# EAGLE design ws2812_Pentagon (EAGLE 8.7.1)
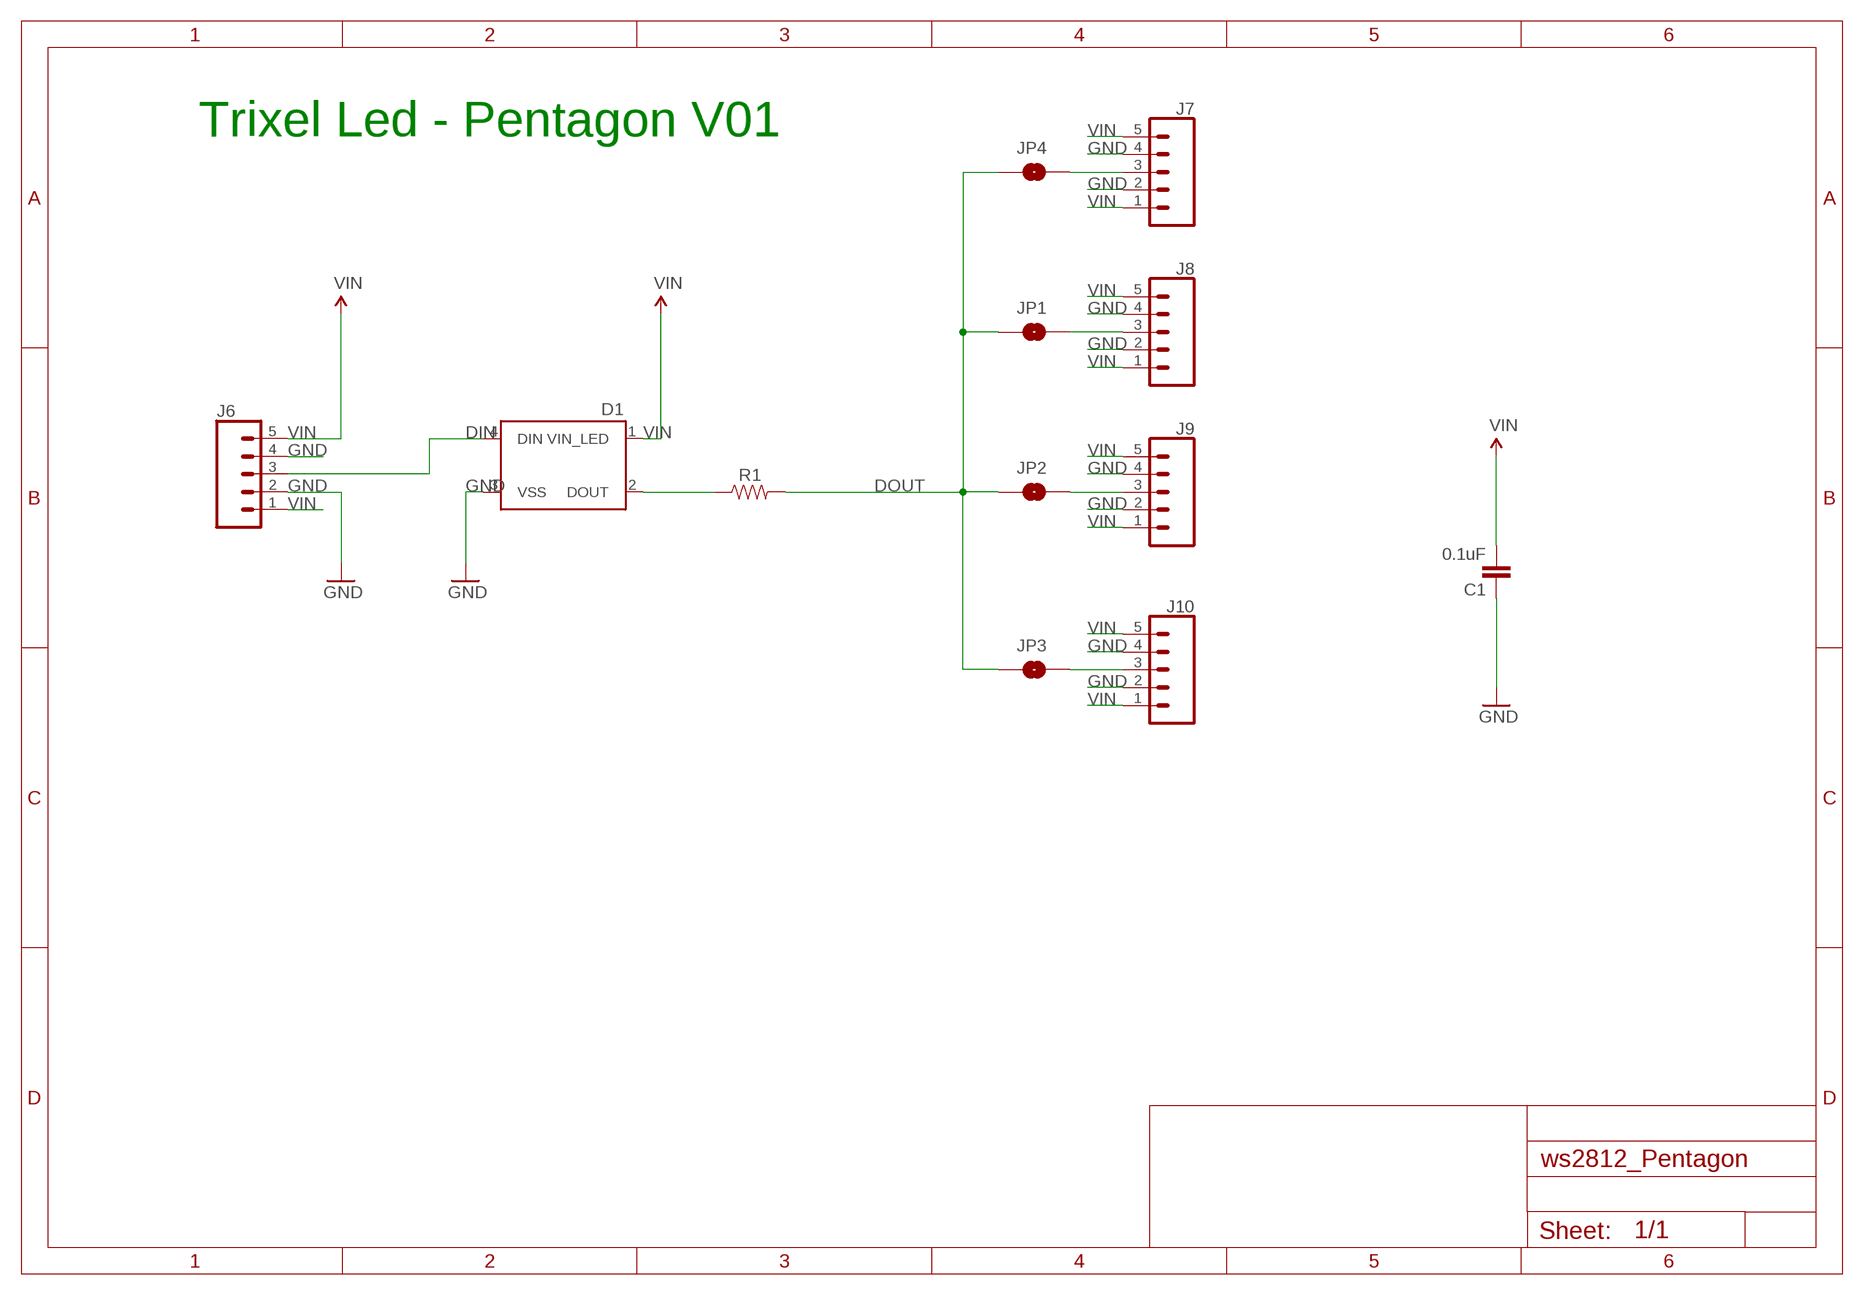
[diagram p0: schematic, sheet 1]

## Parts
C1  0.1uF  CAP0805  [0805]
D1  WS2812B  [WS2812B]
J6  CONN_05PTH_LONGPADS  [1X05_LONGPADS]
J7  CONN_05PTH_LONGPADS  [1X05_LONGPADS]
J8  CONN_05PTH_LONGPADS  [1X05_LONGPADS]
J9  CONN_05PTH_LONGPADS  [1X05_LONGPADS]
J10  CONN_05PTH_LONGPADS  [1X05_LONGPADS]
JP1  JUMPER-PAD-2-NOYES_SILK  [PAD-JUMPER-2-NO_YES_SILK]
JP2  JUMPER-PAD-2-NOYES_SILK  [PAD-JUMPER-2-NO_YES_SILK]
JP3  JUMPER-PAD-2-NOYES_SILK  [PAD-JUMPER-2-NO_YES_SILK]
JP4  JUMPER-PAD-2-NOYES_SILK  [PAD-JUMPER-2-NO_YES_SILK]
R1  RESISTOR0805  [0805]

## Nets
DIN: D1.4(DIN) J6.3
DOUT: JP1.1 JP2.1 JP3.1 JP4.1 R1.2
GND: C1.1 D1.3(VSS) J6.2 J6.4 J7.2 J7.4 J8.2 J8.4 J9.2 J9.4 J10.2 J10.4
N$1: J9.3 JP2.2
N$2: J8.3 JP1.2
N$3: D1.2(DOUT) R1.1
N$4: J7.3 JP4.2
N$5: J10.3 JP3.2
VIN: C1.2 D1.1(VIN_LED) J6.1 J6.5 J7.1 J7.5 J8.1 J8.5 J9.1 J9.5 J10.1 J10.5

## Notes on the sheet
- Trixel Led - Pentagon V01

## Library data of the parts
C1 = SparkFun-Capacitors:CAP: Capacitor Standard 0603 ceramic capacitor, and 0.1" leaded capacitor.
D1 = SparkFun-LED:WS2812B: WS2812B - Intelligent control LED integrated light source Technical Specifications: Power Supply Voltage (VDD): 3.5 to 5.3 V Input Voltage (VI): -0.5 to VDD+0.5 V Operating Junction Temperature (Topt): -25°C to +80°C Storage Temperature Range (Tstg): -55°C to +150°C; PROD_ID: DIO-12503
J6-J10 = SparkFun-Connectors:CONN_05: Multi connection point. Often used as Generic Header-pin footprint for 0.1 inch spaced/style header connections On any of the 0.1 inch spaced packages, you can populate with these: Break Away Headers - Straight <https://www.sparkfun.com/products/116> (PRT-00116) Break Away Male Headers - Right Angle <https://www.sparkfun.com/products/553> (PRT-00553) Female Headers <https://www.sparkfun.com/products/115> (PRT-00115) Break Away Headers - Machine Pin <https://www.sparkfun.com/products/117> (PRT-00117) Break Away Female Headers - Swiss Machine Pin <https://www.sparkfun.com/products/743> (PRT-00743) For SCREWTERMINALS and SPRING TERMINALS visit here: Screw Terimnals on SparkFun.com <https://www.sparkfun.com/search/results?term=Screw+Terminals> (5mm/3.5mm/2.54mm spacing) This device is also useful as a general connection point to wire up your design to another part of your project. Our various solder wires solder well into these plated through hole pads. Hook-Up Wire - Assortment (Stranded, 22 AWG) <https://www.sparkfun.com/products/11375> (PRT-11375) Hook-Up Wire - Assortment (Solid Core, 22 AWG) <https://www.sparkfun.com/products/11367> (PRT-11367) View the entire wire category on our website here <https://www.sparkfun.com/categories/141> Special notes: Molex polarized connector foot print use with SKU : PRT-08231 with associated crimp pins and housings. 1MM SMD Version SKU: PRT-10208
JP1-JP4 = SparkFun-Passives:JUMPER-PAD-2-NO
R1 = SparkFun-Resistors:RESISTOR: Generic Resistor Package

## Board
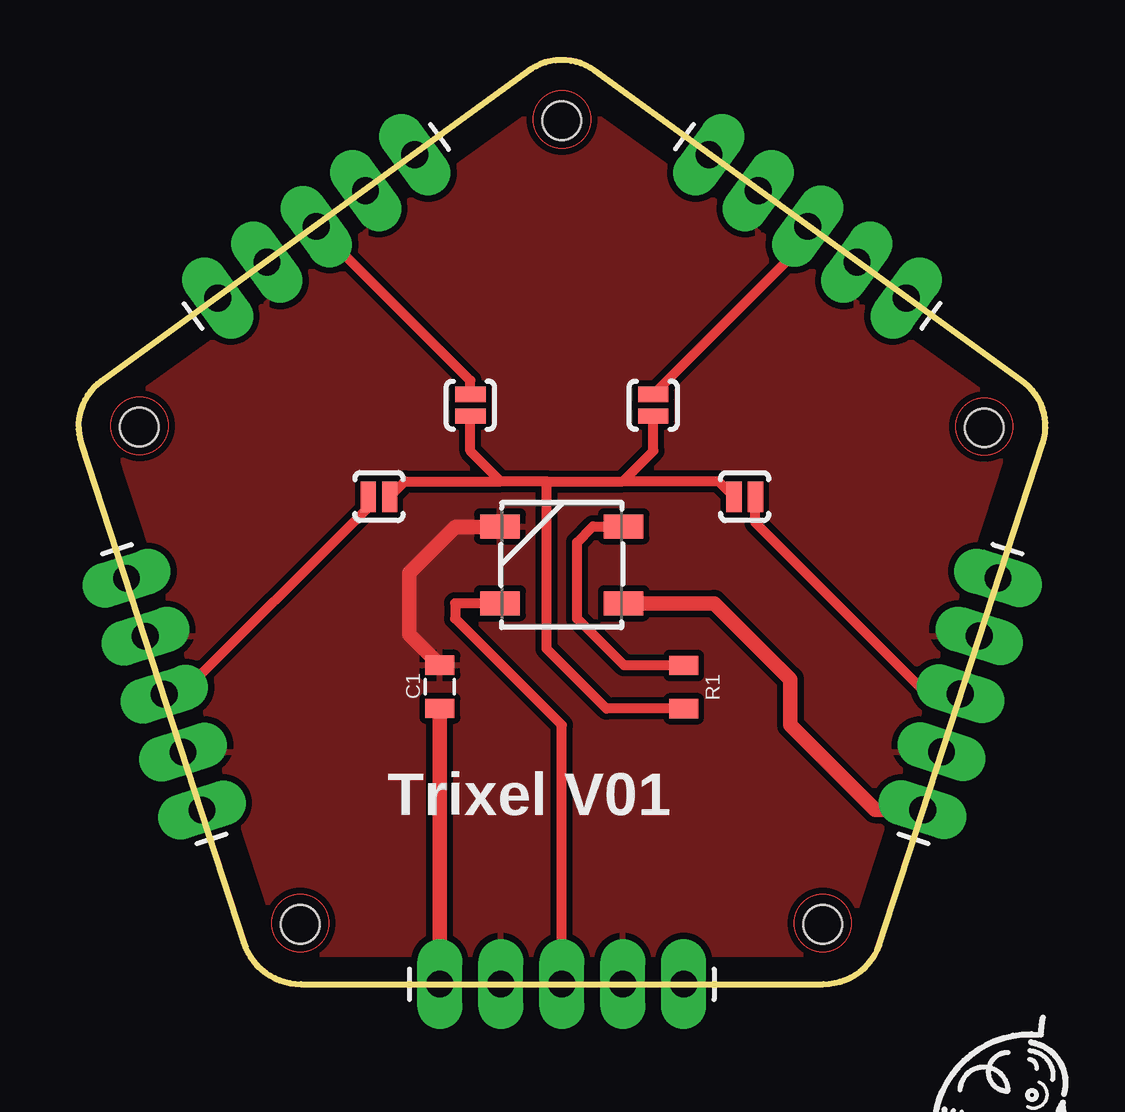
[diagram p1: board, top side]
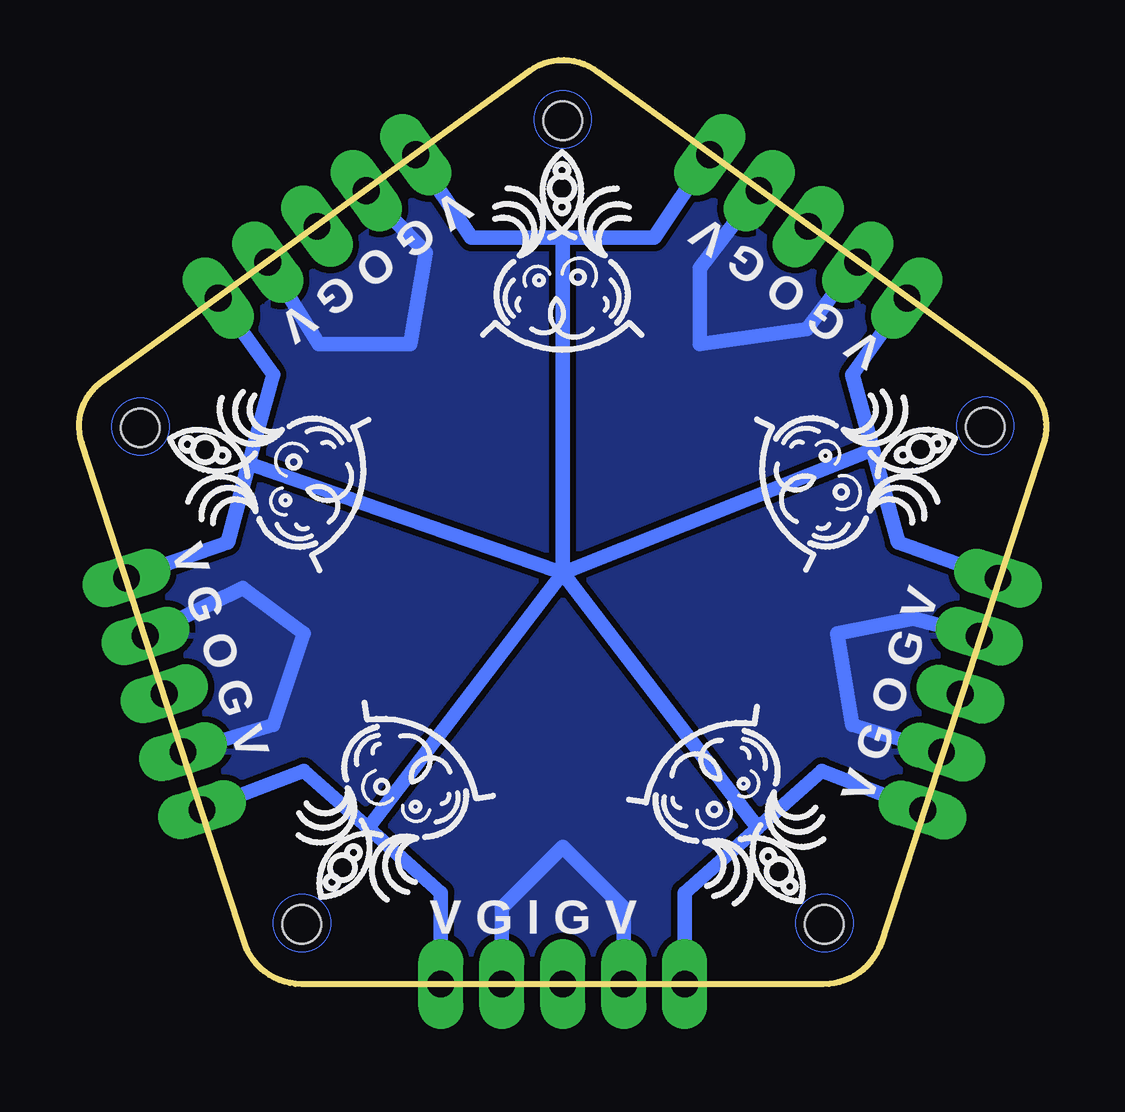
[diagram p2: board, bottom side, seen from below]

Size 40.29 x 38.52 mm. Coordinates in mm from the lower left corner, seen from the top.
Outline: 9.27,0 31.04,0 arc70 33.37,1.63 40.18,22.55 arc75 39.26,25.17 21.51,38.08 arc74 18.69,38.02 0.96,25.15 arc73 0.12,22.5 6.88,1.73 arc72 9.27,0
Copper layers (1*16): Top 0.035mm / dielectric 1.5mm / Bottom 0.035mm
Design rules "SeeedStudio_2layer_DRU_no_angle_20140221 *": minimum track width 6mil, minimum drill 12mil, track to track 6mil, track to pad 6mil, pad to pad 6mil, via to via 6mil, smd to smd 0mil, copper to edge 10mil, drill to drill 10mil, minimum pad ring 10mil, minimum via ring 6mil, stop-mask expansion 2mil, vias tented up to drill 20mil, thermal gap 10mil
Holes 1.6 mm at 9.24,2.49 31.01,2.49 37.74,23.19 2.54,23.22 20.14,35.99

### Footprints (pad centres in the part's own frame; a part is rotated, then mirrored left to right if it is on the bottom)
0805 = smd 0.8 x 1.2: 1 -0.9,0; 2 0.9,0
WS2812B = smd 1.651 x 1: 1 -2.577,1.6; 2 -2.577,-1.6; 3 2.577,-1.6; 4 2.577,1.6
1X05_LONGPADS = drill 1.118 pad 1.88 long: 1 0,0; 2 2.54,0; 3 5.08,0; 4 7.62,0; 5 10.16,0
PAD-JUMPER-2-NO_YES_SILK = smd 0.635 x 1.27: 1 -0.45,0; 2 0.45,0

### Placement (x,y rotation side)
C1  15.06,12.4 270 top
D1  20.14,17.48 180 top
J6  15.06,0 0 top
J7  34.49,28.6 144 top
J8  35.18,7.26 72 top
J9  14.02,34.57 216 top
J10  2,16.92 288 top
JP1  27.76,20.32 0 top
JP2  16.33,24.13 90 top
JP3  12.52,20.32 180 top
JP4  23.95,24.13 90 top
R1  25.22,12.38 270 top

### Tracks (layer width: path | path; a pad name or v marks a point on that pad's centre or on a via)
DIN
  Top 0.406: J6.3 20.14,10.79 15.69,15.24 15.69,15.88 D1.4 | D1.4
DOUT
  Top 0.406: R1.2 21.99,11.48 19.5,13.97 19.5,20.95 | 19.5,20.95 17.6,20.95 | 17.6,20.95 16.33,22.23 JP2.1 | 19.5,20.95 22.68,20.95 | 22.68,20.95 23.95,22.23 JP4.1 | JP1.1 26.67,20.95 22.68,20.95 | JP3.1 13.6,20.95 17.6,20.95
GND
  Top 0.61: D1.3 17.54,19.05 15.69,19.05 13.79,17.14 13.79,14.56 C1.1
  Bottom 0.61: J10.4 8.07,10.79 8.71,14.61 5.53,15.24 J10.2 | J6.2 17.6,3.17 20.14,5.71 22.68,3.17 J6.4 | J8.4 33.47,16.51 30.93,14.61 32.2,10.79 J8.2 | J7.2 30.3,26.67 26.49,26.67 25.85,30.48 J7.4 | J9.2 14.42,29.84 14.42,26.67 9.98,27.3 J9.4
  pour Top (isolate 0.254): 9.34,1.27 30.93,1.27 32.2,2.54 38.55,22.23 37.92,24.45 21.09,36.51 19.19,36.51 2.36,24.45 1.72,22.23 8.07,2.86
  pour Bottom (isolate 0.254): 9.34,1.27 30.93,1.27 32.2,2.54 38.55,22.23 37.92,24.45 21.09,36.51 19.19,36.51 2.36,24.45 1.72,22.23 8.07,2.86
N$1
  Top 0.406: JP2.2 16.33,25.16 J9.3
N$2
  Top 0.406: J8.3 35.35,12.1 28.21,19.23 JP1.2
N$3
  Top 0.406: R1.1 22.73,13.28 20.77,15.24 20.77,18.41 21.43,19.07 D1.2
N$4
  Top 0.406: JP4.2 30.38,31.01 J7.3
N$5
  Top 0.406: J10.3 4.28,12.09 12.07,19.87 JP3.2
VIN
  Top 0.61: J6.1 C1.2 | D1.1 | D1.1 26.49,15.88 29.66,12.7 29.66,10.79 33.19,7.26 J8.1
  Bottom 0.61: J6.1 15.06,3.81 12.02,6.51 | 12.02,6.51 9.34,8.89 J10.5 | J6.5 25.22,3.81 28.25,6.51 | 28.25,6.51 30.93,8.89 J8.1 | J8.5 34.11,18.41 33.21,21.69 | 33.21,21.69 32.2,25.4 J7.1 | J7.5 23.95,31.11 20.14,31.11 | 20.14,31.11 16.33,31.11 J9.1 | J9.5 8.07,25.4 7.22,22.28 | 7.22,22.28 6.17,18.41 J10.1 | 7.22,22.28 20.14,17.14 | 20.14,17.14 20.14,31.11 | 20.14,17.14 33.21,21.69 | 20.14,17.14 28.25,6.51 | 12.02,6.51 20.14,17.14
(copper drawn outside any net)
  shapes: Bottom circle x5, Top circle x5

### Text on the board
tPlace: Trixel V01
bPlace: V G O G V | V G O G V | V G O G V | V G O G V | V G I G V